# EAGLE schematic Placa final (EAGLE 7.7.0)

## Sheet 1 of 2
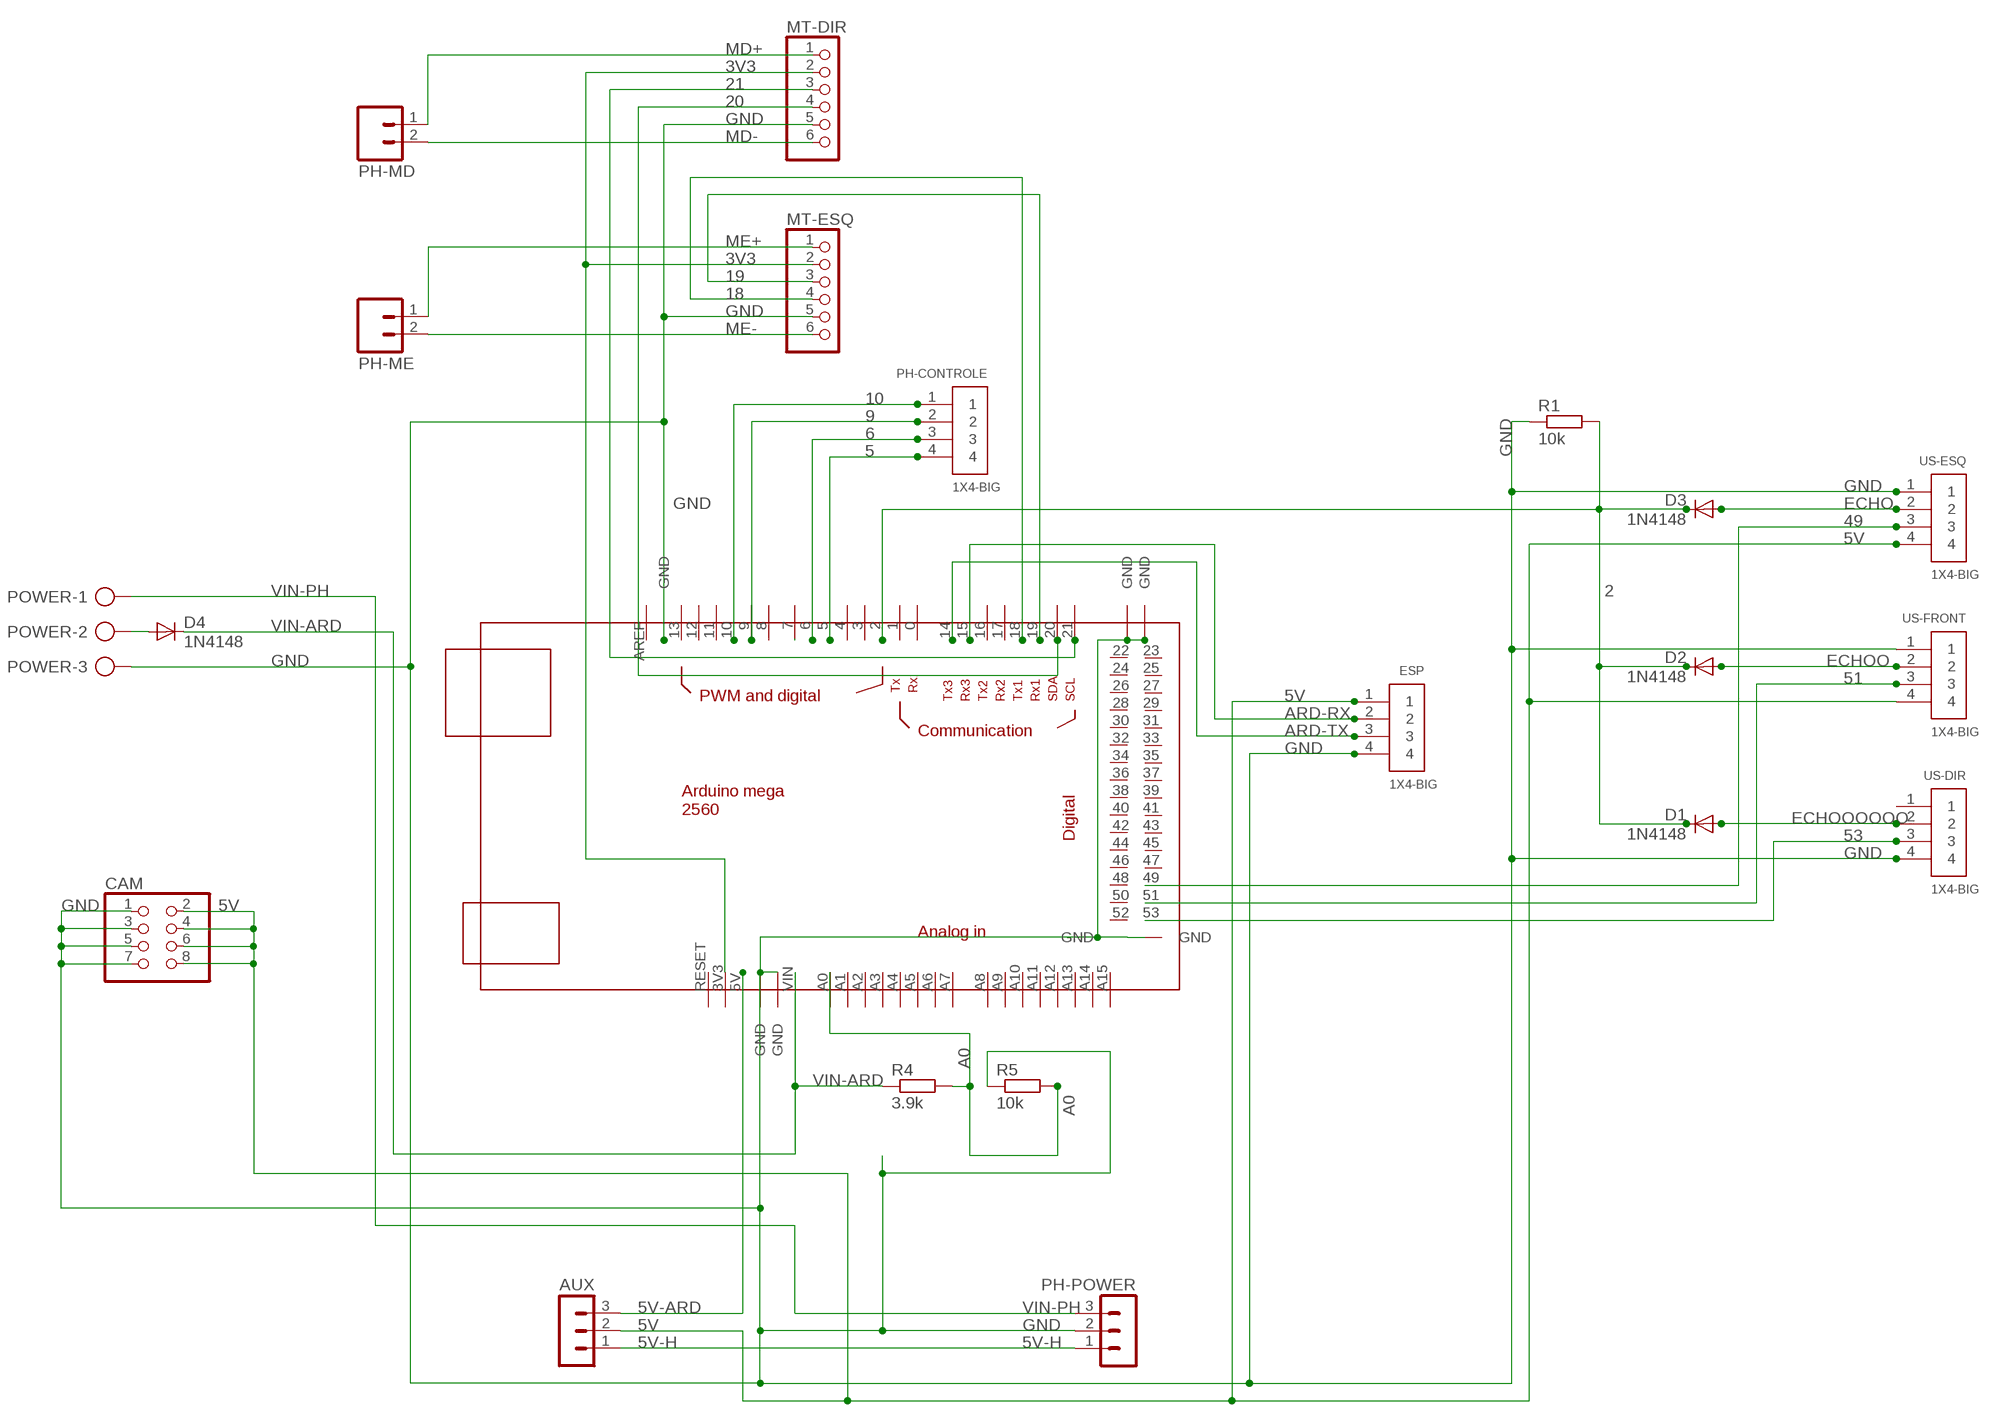
[diagram p0: schematic, sheet 1]

### Parts
AUX  MA03-1  [MA03-1]
CAM  PINHD-2X4  [2X04]
D1  1N4148  1N4446  [DO35-10]
D2  1N4148  1N4446  [DO35-10]
D3  1N4148  1N4446  [DO35-10]
D4  1N4148  1N4446  [DO35-10]
ESP  1X4-BIG  [1X04-BIG]
MT-DIR  PINHD-1X6B  [1X06-BIG]
MT-ESQ  PINHD-1X6B  [1X06-BIG]
PH-CONTROLE  1X4-BIG  [1X04-BIG]
PH-MD  M02  [02P]
PH-ME  M02  [02P]
PH-POWER  MA03-1  [MA03-1]
POWER  AK300/3  [AK300/3]
R1  10k  R0207/10  [0207/10]
R4  3.9k  R0207/10  [0207/10]
R5  10k  R0207/10  [0207/10]
U$1  MEGA_DEVICE  [MEGAOUTLINE]
US-DIR  1X4-BIG  [1X04-BIG]
US-ESQ  1X4-BIG  [1X04-BIG]
US-FRONT  1X4-BIG  [1X04-BIG]

### Nets
2: D1.C D2.C D3.C R1.2 U$1.2
3V3: MT-DIR.2 MT-ESQ.2 U$1.3V3
5: PH-CONTROLE.4 U$1.5
5V: AUX.2 CAM.2 CAM.4 CAM.6 CAM.8 ESP.1 US-ESQ.4 US-FRONT.4
5V-ARD: AUX.3 U$1.5V
5V-H: AUX.1 PH-POWER.1
6: PH-CONTROLE.3 U$1.6
7: U$1.7
9: PH-CONTROLE.2 U$1.9
10: PH-CONTROLE.1 U$1.10
18: MT-ESQ.4 U$1.18
19: MT-ESQ.3 U$1.19
20: MT-DIR.4 U$1.20
21: MT-DIR.3 U$1.21
49: U$1.49 US-ESQ.3
51: U$1.51 US-FRONT.3
53: U$1.53 US-DIR.3
A0: R4.2 R5.2 U$1.A0
ARD-RX: ESP.2 U$1.15
ARD-TX: ESP.3 U$1.14
ECHO: D3.A US-ESQ.2
ECHOO: D2.A US-FRONT.2
ECHOOOOOO: D1.A US-DIR.2
GND: CAM.1 CAM.3 CAM.5 CAM.7 ESP.4 MT-DIR.5 MT-ESQ.5 PH-POWER.2 POWER.3 R1.1 R5.1 U$1.GND@1(GND) U$1.GND@2(GND) U$1.GND@3(GND) U$1.GND@4(GND) U$1.GND@5(GND) U$1.GND@6(GND) U$1.GND@7(GND) US-DIR.4 US-ESQ.1 US-FRONT.1
MD+: MT-DIR.1 PH-MD.1
MD-: MT-DIR.6 PH-MD.2
ME+: MT-ESQ.1 PH-ME.1
ME-: MT-ESQ.6 PH-ME.2
N$1: D4.A POWER.2
VIN-ARD: D4.C R4.1 U$1.VIN
VIN-PH: PH-POWER.3 POWER.1
Unconnected: U$1.0 U$1.1 U$1.3 U$1.4 U$1.8 U$1.11 U$1.12 U$1.13 U$1.16 U$1.17 U$1.22 U$1.23 U$1.24 U$1.25 U$1.26 U$1.27 U$1.28 U$1.29 U$1.30 U$1.31 U$1.32 U$1.33 U$1.34 U$1.35 U$1.36 U$1.37 U$1.38 U$1.39 U$1.40 U$1.41 U$1.42 U$1.43 U$1.44 U$1.45 U$1.46 U$1.47 U$1.48 U$1.50 U$1.52 U$1.A1 U$1.A2 U$1.A3 U$1.A4 U$1.A5 U$1.A6 U$1.A7 U$1.A8 U$1.A9 U$1.A10 U$1.A11 U$1.A12 U$1.A13 U$1.A14 U$1.A15 U$1.AREF U$1.RESET US-DIR.1

## Sheet 2 of 2

## Library data of the parts
AUX PH-POWER = con-lstb:MA03-1: PIN HEADER; OC_FARNELL: unknown; OC_NEWARK: unknown
CAM = adafruit:PINHD-2X4: PIN HEADER
D1-D4 = diode:1N4446: DIODE high speed (Philips)
ESP PH-CONTROLE US-DIR US-ESQ US-FRONT = adafruit:1X4: 4-pin connector
MT-DIR MT-ESQ = adafruit:PINHD-1X6: PIN HEADER
PH-MD PH-ME = con-amp-quick:M02: AMP QUICK CONNECTOR; OC_FARNELL: unknown; OC_NEWARK: unknown
POWER = con-ptr500:AK300/3: CONNECTOR; OC_FARNELL: unknown; OC_NEWARK: unknown
R1 R4 R5 = eagle-ltspice:R: RESISTOR, European symbol; SPICEMODEL: NONE; SPICEPREFIX: R
U$1 = ArduinoMegaOutline:MEGA_DEVICE: mega card as device

## Net classes
0 default: clearance 0.205 mm